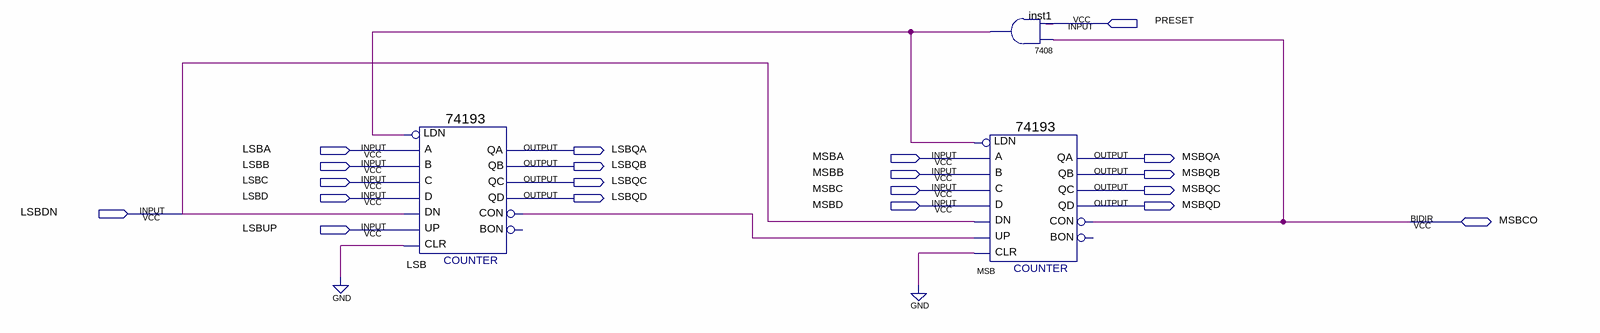
[diagram p0: schematic sheet]
// Quartus schematic Sync_Count.bdf as structural Verilog: 3 symbols, 20 pins
module Sync_Count (
  input  PRESET,
  input  LSBA,
  input  MSBA,
  input  LSBB,
  input  MSBB,
  input  LSBC,
  input  MSBC,
  input  LSBD,
  input  MSBD,
  input  LSBDN,
  input  LSBUP,
  inout  MSBCO,
  output LSBQA,
  output MSBQA,
  output LSBQB,
  output MSBQB,
  output LSBQC,
  output MSBQC,
  output LSBQD,
  output MSBQD
);

  wire inst1_1, LSB_con;

  \74193  LSB (
    .D(LSBD), .C(LSBC), .B(LSBB), .A(LSBA), .CLR(1'b0), .UP(LSBUP), .DN(LSBDN), .LDN(inst1_1), .QB(LSBQB),
    .QA(LSBQA), .CON(LSB_con), .QD(LSBQD), .QC(LSBQC));  // open: BON
  \74193  MSB (
    .D(MSBD), .C(MSBC), .B(MSBB), .A(MSBA), .CLR(1'b0), .UP(LSB_con), .DN(LSBDN), .LDN(inst1_1), .QB(MSBQB),
    .QA(MSBQA), .CON(MSBCO), .QD(MSBQD), .QC(MSBQC));  // open: BON
  \7408  inst1 (.\3 (PRESET), .\2 (MSBCO), .\1 (inst1_1));
endmodule
